# Altium schematic sheet [02] - POWER CONVERTERS.SchDoc: Desk Digital Clock
size A4; DrawnBy: Ramil Teregulov; Address1: http://github.com/teregulov; Address2: http://github.com/teregulov/Desk-Digital-Clock; DocumentNumber: DDC-7; Revision: 1R0; SheetNumber: 7; SheetTotal: 7
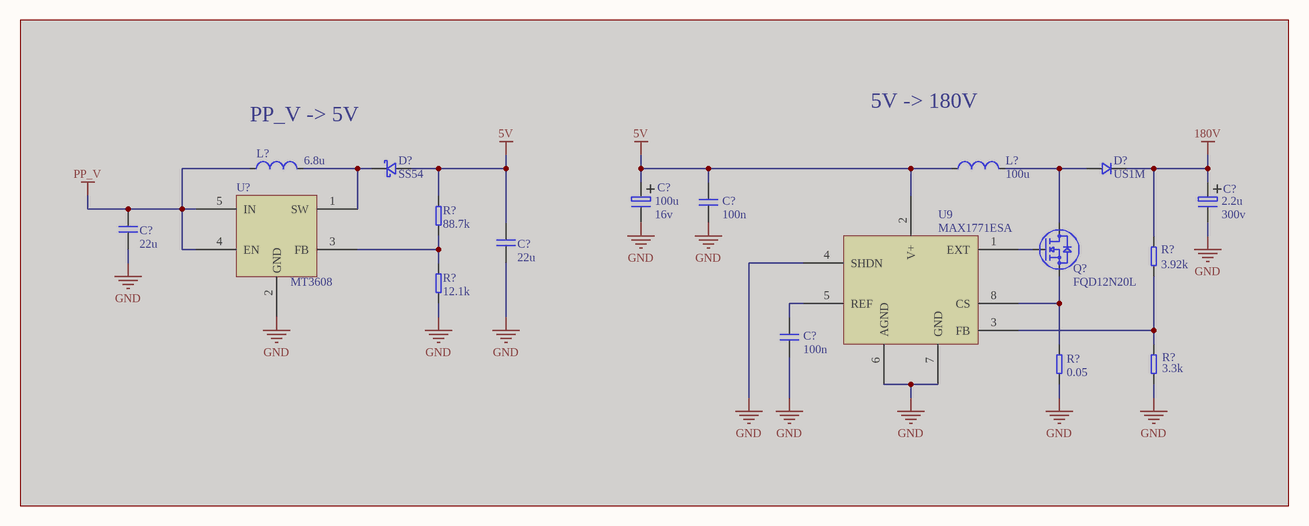
[diagram p0: [02] - POWER CONVERTERS.SchDoc]

## Parts
(Parts that share a designator on the sheet are numbered #1, #2 ... from top to bottom, then left to right.)
C?#1  Voltage: 16v  [CAPM3216X18N_TANTAL_E]  (hidden comment: 100u)  (masked out: inside a compile mask, not in the netlist)
C?#2  Voltage: 300v  [CAP_8X10.2]  (hidden comment: 2.2u)  (masked out: inside a compile mask, not in the netlist)
C?#3  100n  [C0603]  (masked out: inside a compile mask, not in the netlist)
C?#4  22u  [C1210]  (masked out: inside a compile mask, not in the netlist)
C?#5  22u  [C1210]  (masked out: inside a compile mask, not in the netlist)
C?#6  100n  [C0603]  (masked out: inside a compile mask, not in the netlist)
D?#1  (no value)  [DO-214AC(SMA)]  (masked out: inside a compile mask, not in the netlist)
D?#2  P/N: SS54  [DIOM6959X26N-SS54]  (masked out: inside a compile mask, not in the netlist)
L?#1  6.8u  [CDRH5D16]  (masked out: inside a compile mask, not in the netlist)
L?#2  100u  [CD127-IND]  (masked out: inside a compile mask, not in the netlist)
Q?  FQD12N20L  [DPAK-fqd12n20l]  (masked out: inside a compile mask, not in the netlist)
R?#1  88.7k  [R0603]  (masked out: inside a compile mask, not in the netlist)
R?#2  3.92k  [R0603]  (masked out: inside a compile mask, not in the netlist)
R?#3  12.1k  [R0603]  (masked out: inside a compile mask, not in the netlist)
R?#4  0.05  [R1206]  (masked out: inside a compile mask, not in the netlist)
R?#5  3.3k  [R0603]  (masked out: inside a compile mask, not in the netlist)
U9  MAX1771ESA  [MAX1771ESA]
U?  MT3608  [SOT23-6-MT3420C]  (masked out: inside a compile mask, not in the netlist)

## Nets

Not connected (* = marked no-connect by the designer): U9 1(EXT) 2(V+) 3(FB) 4(SHDN) 5(REF) 6(AGND) 7(GND) 8(CS)

## Notes on the sheet
- PP_V -> 5V
- 5V -> 180V
- Title:
- Size:
- Date:
- A4
- Number:
- Time:
- Revision:
- Sheet
- of
- File:

## Library data of the parts
C?#1 C?#2 = Cap_p: CAPACITOR
  C?#1: Value: 100u
  C?#2: Value: 2.2u
C?#3-C?#6 = Cap: CAPACITOR
  C?#3 C?#6: Value: 100n
  C?#4 C?#5: Value: 22u
D?#1 = US1M: 1.0A SURFACE MOUNT ULTRA-FAST RECTIFIER; Manufacturer: Vishay; Datasheet: https://www.vishay.com/docs/88768/us1_test_dcicons.pdf; P/N: US1M
D?#2 = Diode_Shottky: Diode Shottky; Datasheet: https://static.chipdip.ru/lib/321/DOC005321659.pdf
L?#1 = Ind: INDUCTOR; P/N: CDRH5D16NP-680MC; Value: 6.8u
L?#2 = Ind: INDUCTOR; Value: 100u
Q? = FQD12N20L: n-Channel QFET MOSFET 200V 9A 280mOhm; Manufacturer: Fairchild Semiconductor; P/N: FQD12N20L; Datasheet: https://www.onsemi.com/download/data-sheet/pdf/fqd12n20l-d.pdf; Package: D-PAK
R?#1-R?#5 = Res: RESISTOR
  R?#1: Value: 88.7k
  R?#2: Value: 3.92k
  R?#3: Value: 12.1k
  R?#4: Value: 0.05
  R?#5: Value: 3.3k
U9 = MAX1771ESA: 12V or Adjustable, High-Efficiency, / Low IQ, Step-Up DC-DC Controller; Manufacturer: Maxim; Datasheet: https://static.chipdip.ru/lib/300/DOC000300892.pdf; P/N: MAX1771ESA
U? = MT3608: High Efficiency 1.2MHz 2A Step Up Converter; Manufacturer: Aerosemi; Datasheet: https://www.olimex.com/Products/Breadboarding/BB-PWR-3608/resources/MT3608.pdf; P/N: MT3608